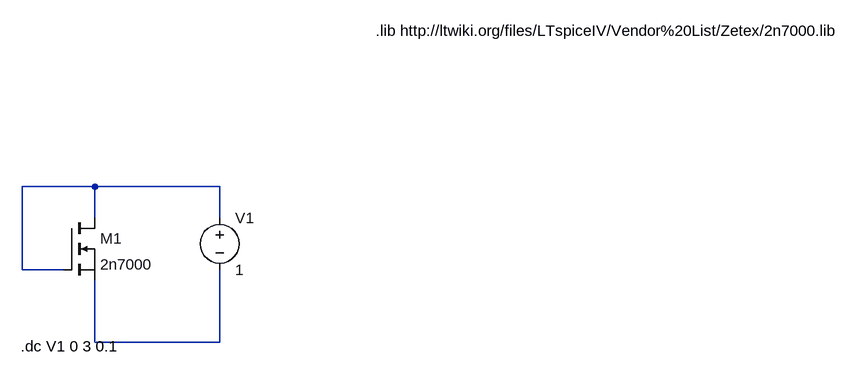
[diagram p0: schematic Draft1.asc]
Draft1.asc, the LTspice schematic file:
Version 4
SHEET 1 1400 680
WIRE 192 96 80 96
WIRE 384 96 192 96
WIRE 192 144 192 96
WIRE 384 144 384 96
WIRE 80 224 80 96
WIRE 144 224 80 224
WIRE 192 336 192 240
WIRE 384 336 384 224
WIRE 384 336 192 336
SYMBOL nmos 144 144 R0
SYMATTR InstName M1
SYMATTR Value 2n7000
SYMBOL voltage 384 128 R0
WINDOW 123 0 0 Left 2
WINDOW 39 0 0 Left 2
SYMATTR InstName V1
SYMATTR Value 1
TEXT 624 -144 Left 2 !.lib http://ltwiki.org/files/LTspiceIV/Vendor%20List/Zetex/2n7000.lib
TEXT 78 342 Left 2 !.dc V1 0 3 0.1

The netlist it stands for:
* Draft1.asc
M1 N001 N001 N002 N002 2n7000
V1 N001 N002 1
.model NMOS NMOS
.model PMOS PMOS
.lib standard.mos
.lib http://ltwiki.org/files/LTspiceIV/Vendor%20List/Zetex/2n7000.lib
.dc V1 0 3 0.1
.backanno
.end